# EAGLE design old_motor+line (EAGLE 7.7.0)
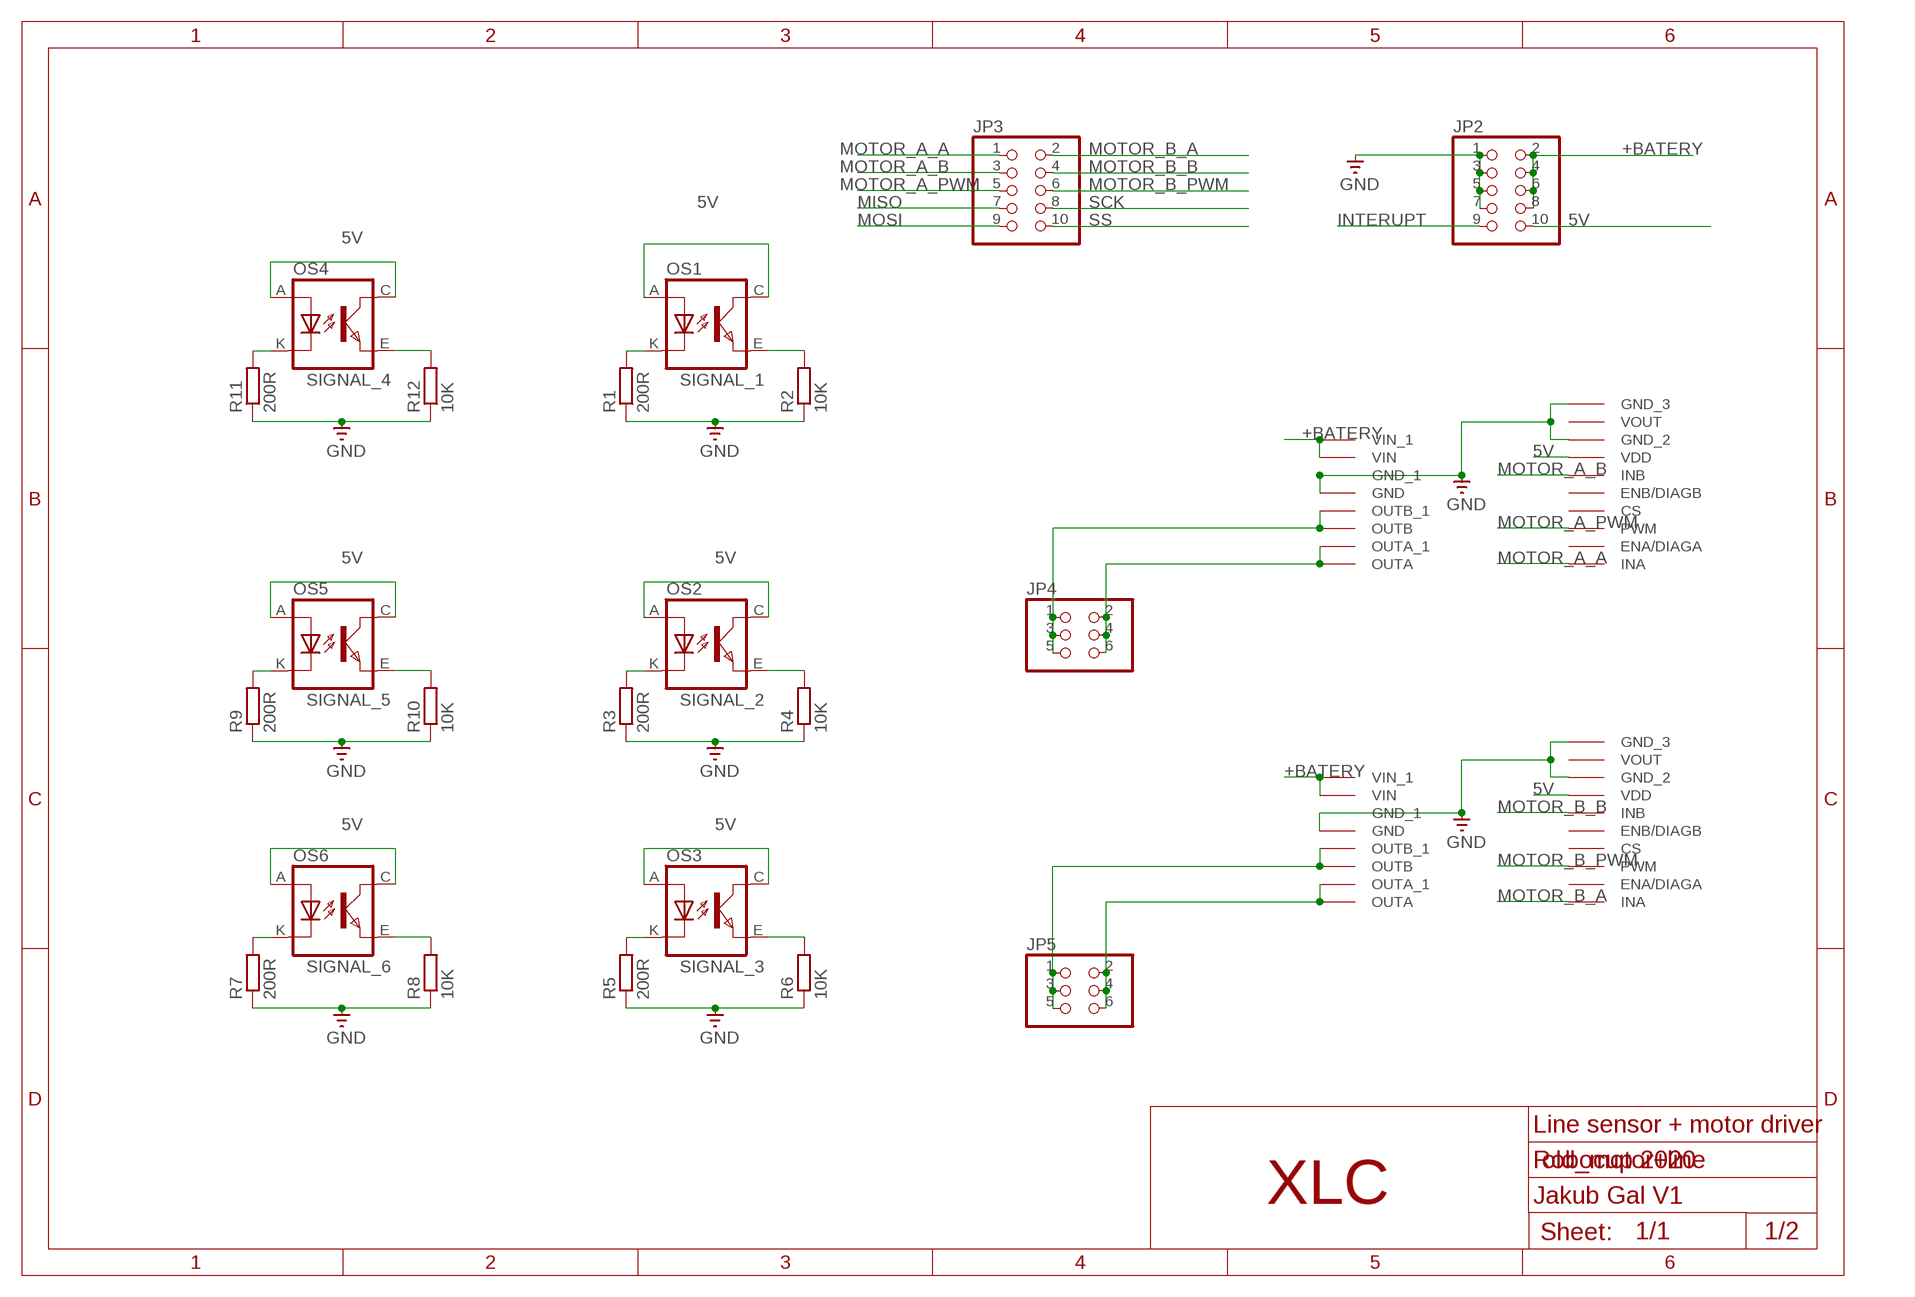
[diagram p0: schematic, sheet 1, part 1 of 2]
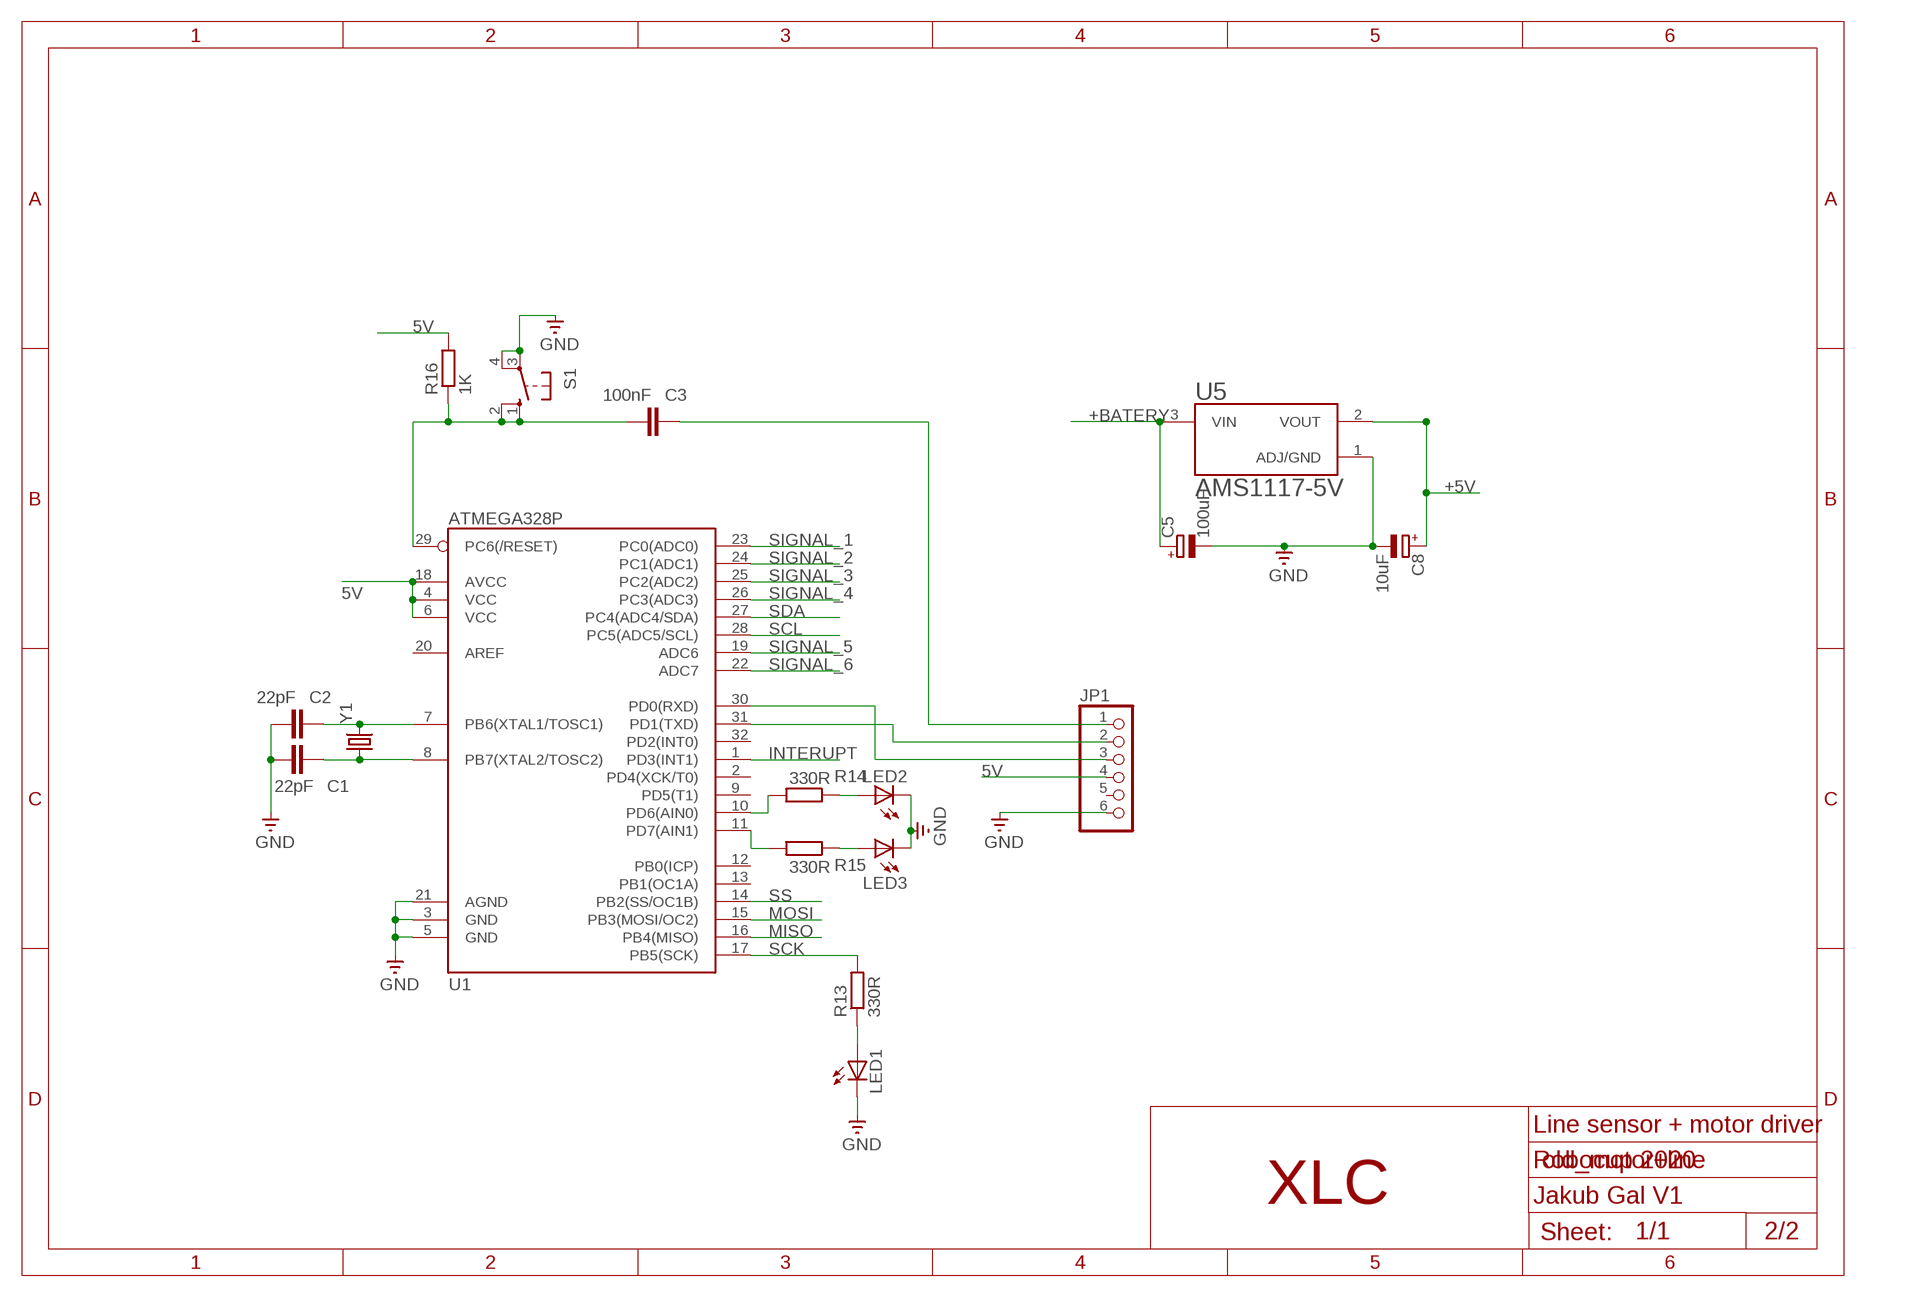
[diagram p1: schematic, sheet 1, part 2 of 2]

## Parts
C1  22pF  C-EUC0603  [C0603]
C2  22pF  C-EUC0603  [C0603]
C3  100nF  C-EUC0603  [C0603]
C5  100uF  CPOL-EUUD-6,3X7,7  [UD-6,3X7,7_NICHICON]
C8  10uF  CPOL-EUUD-4X5,8  [UD-4X5,8_NICHICON]
JP1  PINHD-1X6/90  [1X06/90]
JP2  PINHD-2X5  [2X05]
JP3  PINHD-2X5  [2X05]
JP4  PINHD-2X3  [2X03]
JP5  PINHD-2X3  [2X03]
LED1  LEDCHIPLED_0603  [CHIPLED_0603]
LED2  LEDCHIPLED_0603  [CHIPLED_0603]
LED3  LEDCHIPLED_0603  [CHIPLED_0603]
OS1  TCRT5000  [TCRT5000]
OS2  TCRT5000  [TCRT5000]
OS3  TCRT5000  [TCRT5000]
OS4  TCRT5000  [TCRT5000]
OS5  TCRT5000  [TCRT5000]
OS6  TCRT5000  [TCRT5000]
R1  200R  R-EU_R0603  [R0603]
R2  10K  R-EU_R0603  [R0603]
R3  200R  R-EU_R0603  [R0603]
R4  10K  R-EU_R0603  [R0603]
R5  200R  R-EU_R0603  [R0603]
R6  10K  R-EU_R0603  [R0603]
R7  200R  R-EU_R0603  [R0603]
R8  10K  R-EU_R0603  [R0603]
R9  200R  R-EU_R0603  [R0603]
R10  10K  R-EU_R0603  [R0603]
R11  200R  R-EU_R0603  [R0603]
R12  10K  R-EU_R0603  [R0603]
R13  330R  R-EU_R0603  [R0603]
R14  330R  R-EU_R0603  [R0603]
R15  330R  R-EU_R0603  [R0603]
R16  1K  R-EU_R0603  [R0603]
S1  10-XX  [B3F-10XX]
U1  ATMEGA328P  ATMEGA328_SMT  [TQFP32-08]
U5  AMS1117-5V  AMS1117-3.3  [SOT229P700X180-4N]
U$1  MOTOR_DRIVER  [MOTOR_DRIVER]
U$2  MOTOR_DRIVER  [MOTOR_DRIVER]
Y1  CRYSTALHC49US  [HC49US]

## Nets
5V: JP1.4 JP2.10 OS1.A(ANODE) OS1.C(COLLECTOR) OS2.A(ANODE) OS2.C(COLLECTOR) OS3.A(ANODE) OS3.C(COLLECTOR) OS4.A(ANODE) OS4.C(COLLECTOR) OS5.A(ANODE) OS5.C(COLLECTOR) OS6.A(ANODE) OS6.C(COLLECTOR) R16.2 U1.4(VCC) U1.6(VCC) U1.18(AVCC) U$1.VDD U$2.VDD
+5V: C8.+ U5.2(VOUT)
+BATERY: C5.+ JP2.2 JP2.4 JP2.6 JP2.8 U5.3(VIN) U$1.VIN U$1.VIN_1 U$2.VIN U$2.VIN_1
GND: C1.1 C2.1 C5.- C8.- JP1.6 JP2.1 JP2.3 JP2.5 JP2.7 LED1.C LED2.C LED3.C R1.1 R2.1 R3.1 R4.1 R5.1 R6.1 R7.1 R8.1 R9.1 R10.1 R11.1 R12.1 S1.3(P) S1.4(P1) U1.3(GND) U1.5(GND) U1.21(AGND) U5.1(ADJ/GND) U$1.GND U$1.GND_1 U$1.GND_2 U$1.GND_3 U$2.GND U$2.GND_1 U$2.GND_2 U$2.GND_3
INTERUPT: JP2.9 U1.1(PD3(INT1))
MISO: JP3.7 U1.16(PB4(MISO))
MOSI: JP3.9 U1.15(PB3(MOSI/OC2))
MOTOR_1_1: JP4.1 JP4.3 JP4.5 U$1.OUTB U$1.OUTB_1
MOTOR_1_2: JP4.2 JP4.4 JP4.6 U$1.OUTA U$1.OUTA_1
MOTOR_2_1: JP5.2 JP5.4 JP5.6 U$2.OUTA U$2.OUTA_1
MOTOR_2_2: JP5.1 JP5.3 JP5.5 U$2.OUTB U$2.OUTB_1
MOTOR_A_A: JP3.1 U$1.INA
MOTOR_A_B: JP3.3 U$1.INB
MOTOR_A_PWM: JP3.5 U$1.PWM
MOTOR_B_A: JP3.2 U$2.INA
MOTOR_B_B: JP3.4 U$2.INB
MOTOR_B_PWM: JP3.6 U$2.PWM
N$1: OS1.K(CATHODE) R1.2
N$2: OS2.K(CATHODE) R3.2
N$3: OS3.K(CATHODE) R5.2
N$4: OS6.K(CATHODE) R7.2
N$5: OS5.K(CATHODE) R9.2
N$6: OS4.K(CATHODE) R11.2
N$7: C2.2 U1.7(PB6(XTAL1/TOSC1)) Y1.2
N$8: C1.2 U1.8(PB7(XTAL2/TOSC2)) Y1.1
N$13: JP1.3 U1.30(PD0(RXD))
N$14: JP1.2 U1.31(PD1(TXD))
N$15: C3.2 JP1.1
N$16: C3.1 R16.1 S1.1(S) S1.2(S1) U1.29(PC6(/RESET))
N$17: LED1.A R13.1
N$19: LED2.A R14.1
N$20: R15.2 U1.11(PD7(AIN1))
N$21: LED3.A R15.1
N$22: R14.2 U1.10(PD6(AIN0))
SCK: JP3.8 R13.2 U1.17(PB5(SCK))
SCL: U1.28(PC5(ADC5/SCL))
SDA: U1.27(PC4(ADC4/SDA))
SIGNAL_1: OS1.E(EMITTER) R2.2 U1.23(PC0(ADC0))
SIGNAL_2: OS2.E(EMITTER) R4.2 U1.24(PC1(ADC1))
SIGNAL_3: OS3.E(EMITTER) R6.2 U1.25(PC2(ADC2))
SIGNAL_4: OS4.E(EMITTER) R12.2 U1.26(PC3(ADC3))
SIGNAL_5: OS5.E(EMITTER) R10.2 U1.19(ADC6)
SIGNAL_6: OS6.E(EMITTER) R8.2 U1.22(ADC7)
SS: JP3.10 U1.14(PB2(SS/OC1B))
Unconnected: JP1.5 U1.2(PD4(XCK/T0)) U1.9(PD5(T1)) U1.12(PB0(ICP)) U1.13(PB1(OC1A)) U1.20(AREF) U1.32(PD2(INT0)) U$1.CS U$1.ENA/DIAGA U$1.ENB/DIAGB U$1.VOUT U$2.CS U$2.ENA/DIAGA U$2.ENB/DIAGB U$2.VOUT

## Notes on the sheet
- Line sensor + motor driver | Line sensor + motor driver
- Robocup 2020 | Robocup 2020
- XLC | Jakub Gal V1 | XLC | Jakub Gal V1
- 1/2 | 2/2

## Library data of the parts
C1-C3 = rcl@1:C-EU: CAPACITOR, European symbol
C5 C8 = rcl:CPOL-EU: POLARIZED CAPACITOR, European symbol; SPICEPREFIX: C
JP1 = SERVO:PINHD-1X6: PIN HEADER
JP2 JP3 = pinhead:PINHD-2X5: PIN HEADER
JP4 JP5 = pinhead:PINHD-2X3: PIN HEADER
LED1-LED3 = audio amplifier example:LED
OS1-OS3 OS5 = tcrt5000:TCRT5000
OS4 OS6 = tcrt5000:TCRT5000; SPICEPREFIX: O
R1-R16 = rcl:R-EU_: RESISTOR, European symbol; SPICEPREFIX: R
S1 = switch-omron:10-XX: OMRON SWITCH; MPN: B3F-1000; OC_FARNELL: 176432; OC_NEWARK: 36M3542
U1 = SparkFun-DigitalIC:ATMEGA328_SMT: 32-Pin Atmega328 part Commonly used on Arduino compatible boards Available in QFP and QFN packages TQFP is IC-09069 QFN is non-stock; PROD_ID: IC-09069
U5 = AMS1117-3.3:AMS1117-3.3: Sot223/Pkg 1-Amp 3.3-Volt Low Drop Out Voltage Regulatator; AVAILABILITY: Unavailable; DESCRIPTION: Sot223/Pkg 1-Amp 3.3-Volt Low Drop Out Voltage Regulatator; MF: Advanced Monolithic Systems; MP: AMS1117-3.3; PACKAGE: None; PRICE: None
U$1 U$2 = Moja:MOTOR_DRIVER
Y1 = SparkFun-FreqCtrl:CRYSTAL: Various standard crystals. Proven footprints. Spark Fun Electronics SKU : COM-00534

## Board
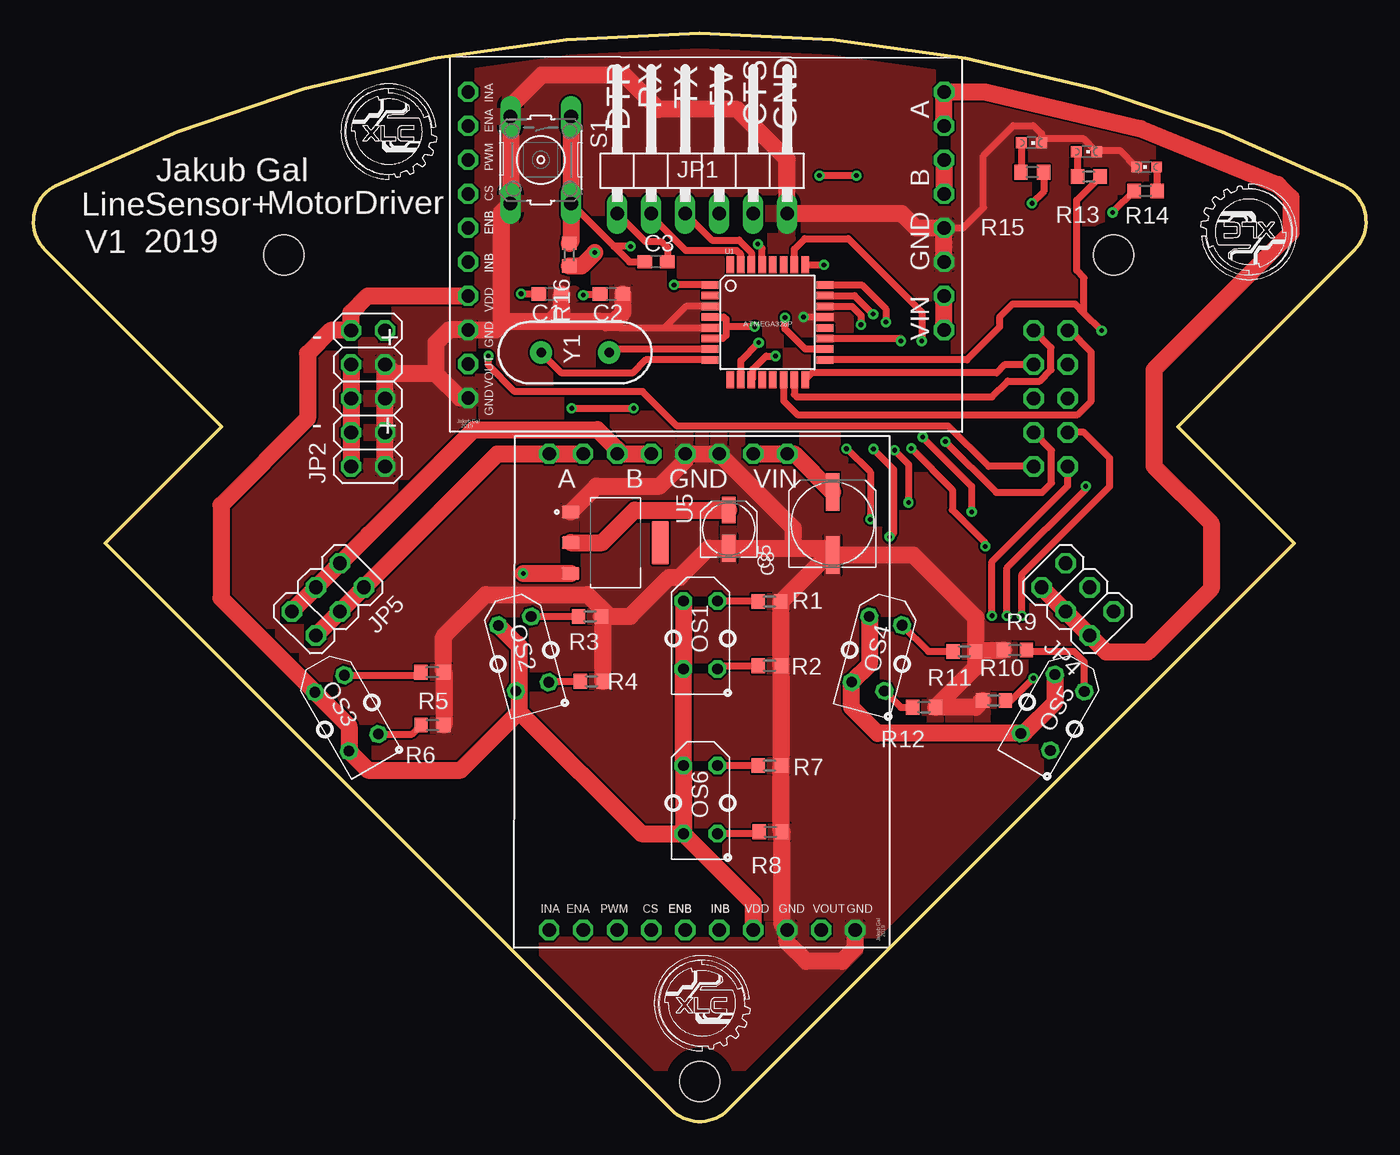
[diagram p2: board, top side]
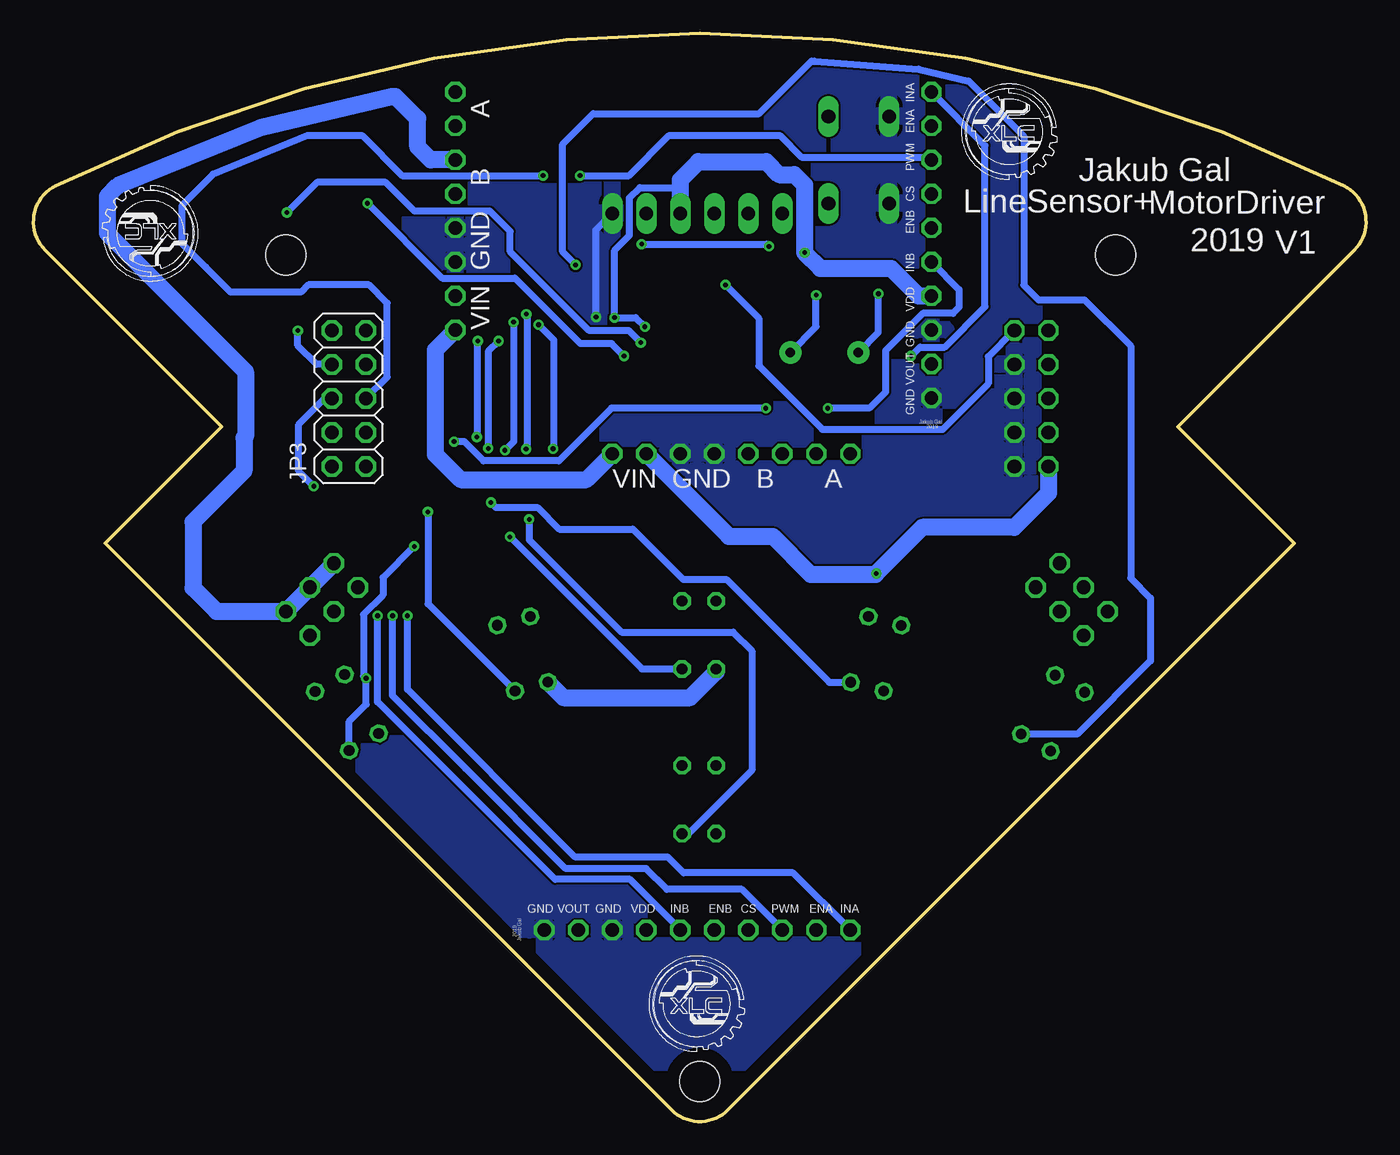
[diagram p3: board, bottom side, seen from below]

Size 99.55 x 81.25 mm. Coordinates in mm from the lower left corner, seen from the top.
Outline: 85.49,51.89 98.67,65.08 arc108 97.9,69.88 arc53 1.66,69.88 arc108 0.88,65.08 14.07,51.89 5.35,43.18 47.66,0.87 arc90 51.9,0.87 94.2,43.18 85.49,51.89
Copper layers (1*16): Top 0.035mm / dielectric 1.5mm / Bottom 0.035mm
Design rules "default": minimum track width 6mil, minimum drill 0.35mm, track to track 6mil, track to pad 6mil, pad to pad 6mil, via to via 6mil, smd to smd 6mil, copper to edge 40mil, drill to drill 6mil, minimum pad ring 10mil, minimum via ring 8mil, stop-mask expansion 4mil, vias tented up to drill 0mil, thermal gap 10mil
Holes 3 mm at 49.78,3 18.71,64.71 80.71,64.71

### Footprints (pad centres in the part's own frame; a part is rotated, then mirrored left to right if it is on the bottom)
C0603 = smd 1.1 x 1: 1 -0.85,0; 2 0.85,0
UD-6,3X7,7_NICHICON = smd 2.8 x 1: + 2.35,0; - -2.35,0
UD-4X5,8_NICHICON = smd 2 x 1: + 1.425,0; - -1.425,0
1X06/90 = drill 1.016 long: 1 -6.35,-3.81; 2 -3.81,-3.81; 3 -1.27,-3.81; 4 1.27,-3.81; 5 3.81,-3.81; 6 6.35,-3.81
2X05 = drill 1.016 octagon: 1 -5.08,-1.27; 2 -5.08,1.27; 3 -2.54,-1.27; 4 -2.54,1.27; 5 0,-1.27; 6 0,1.27; 7 2.54,-1.27; 8 2.54,1.27; 9 5.08,-1.27; 10 5.08,1.27
2X03 = drill 1.016 octagon: 1 -2.54,-1.27; 2 -2.54,1.27; 3 0,-1.27; 4 0,1.27; 5 2.54,-1.27; 6 2.54,1.27
CHIPLED_0603 = smd 0.8 x 0.8: A 0,-0.75; C 0,0.75
TCRT5000 = drill 0.8 octagon: A -2.54,-1.27; C 2.54,-1.27; E 2.54,1.27; K -2.54,1.27
R0603 = smd 1 x 1.1: 1 -0.85,0; 2 0.85,0
B3F-10XX = drill 1.016 long: 1 -3.251,2.261; 2 3.251,2.261; 3 -3.251,-2.261; 4 3.251,-2.261
TQFP32-08 = smd 1.27 x 0.559: 1 -4.293,2.8; 2 -4.293,2; 3 -4.293,1.2; 4 -4.293,0.4; 5 -4.293,-0.4; 6 -4.293,-1.2; 7 -4.293,-2; 8 -4.293,-2.8; 17 4.293,-2.8; 18 4.293,-2; 19 4.293,-1.2; 20 4.293,-0.4; 21 4.293,0.4; 22 4.293,1.2; 23 4.293,2; 24 4.293,2.8 | smd 0.559 x 1.27: 9 -2.8,-4.293; 10 -2,-4.293; 11 -1.2,-4.293; 12 -0.4,-4.293; 13 0.4,-4.293; 14 1.2,-4.293; 15 2,-4.293; 16 2.8,-4.293; 25 2.8,4.293; 26 2,4.293; 27 1.2,4.293; 28 0.4,4.293; 29 -0.4,4.293; 30 -1.2,4.293; 31 -2,4.293; 32 -2.8,4.293
SOT229P700X180-4N = smd 0.93 x 1.31: 1 -2.29,-3.345; 2 0,-3.345; 3 2.29,-3.345 | smd 3.24 x 1.31: 4 0,3.345
MOTOR_DRIVER = drill 1 octagon: CS -2.54,-17.78; ENA/DIAGA -7.62,-17.78; ENB/DIAGB 0,-17.78; GND 0,17.78; GND_1 2.54,17.78; GND_2 7.62,-17.78; GND_3 12.7,-17.78; INA -10.16,-17.78; INB 2.54,-17.78; OUTA -10.16,17.78; OUTA_1 -7.62,17.78; OUTB -5.08,17.78; OUTB_1 -2.54,17.78; PWM -5.08,-17.78; VDD 5.08,-17.78; VIN 5.08,17.78; VIN_1 7.62,17.78; VOUT 10.16,-17.78
HC49US = drill 0.7 pad 1.651: 1 -2.54,0; 2 2.54,0

### Placement (x,y rotation side)
C1  38.61,61.8 180 top
C2  43.18,61.8 180 top
C3  46.51,64.21 0 top
C5  59.7,44.66 90 top
C8  51.94,44.24 90 top
JP1  49.96,71.63 0 top
JP2  25,54 90 top
JP3  76,54 90 bottom
JP4  78,39 135 top
JP5  22,39 225 top
LED1  78.67,72.43 270 top
LED2  83.16,71.28 90 top
LED3  74.55,73.09 270 top
OS1  49.83,36.34 270 top
OS2  36.61,34.93 285 top
OS3  23.4,30.5 300 top
OS4  63.01,34.94 255 top
OS5  76.13,30.54 240 top
OS6  49.83,24.04 270 top
R1  54.99,38.83 180 top
R2  55,34.04 180 top
R3  41.57,37.72 180 top
R4  41.7,32.88 180 top
R5  29.8,33.56 180 top
R6  29.81,29.61 180 top
R7  55,26.58 180 top
R8  55.07,21.64 180 top
R9  73.33,35.21 0 top
R10  71.76,31.45 0 top
R11  69.56,35.11 180 top
R12  66.54,30.94 180 top
R13  78.85,70.57 0 top
R14  83.08,69.5 180 top
R15  74.62,70.9 0 top
R16  40.03,64.74 270 top
S1  37.9,71.82 270 top
U1  54.84,59.68 0 top
U5  43.48,43.23 270 top
U$1  50.25,66.74 270 top
U$2  48.69,32.09 0 top
Y1  40.47,57.43 0 top

### Tracks (layer width: path | path; a pad name or v marks a point on that pad's centre or on a via)
5V  (via drill 0.35)
  Top 0.508: U1.4 51.58,60.08 51.74,59.92 51.74,59.34 | 51.74,59.34 51.74,58.71 51.51,58.48 U1.6 | U1.18 57.66,57.68 56.14,59.2 v56.14,60.04 | v53.88,59.36 53.86,59.34 51.74,59.34
  Top 1.27: U$1.VDD 24.98,61.66 23.73,60.41 JP2.10 22.22,59.08 20.48,57.34 20.48,52.51 14.01,46.04 14.01,39.08 OS3.A 23.57,29.52 OS3.C 24.98,26.25 31.92,26.25 36.29,30.62 | OS6.C OS6.A OS1.C OS1.A | OS4.A 62.44,34.13 OS4.C 61.12,30.92 63.07,28.98 OS5.C 74.01,28.98 76.3,31.28 OS5.A | OS2.A 35.96,35.82 35.97,35.82 36.29,35.5 36.29,32.39 | 36.29,32.39 OS2.C | 36.29,32.39 36.29,30.62 | 36.29,30.62 45.41,21.5 OS6.C | OS6.C 53.77,16.29 U$2.VDD | v41.94,64.89 40.94,63.89 R16.2
  Bottom 0.508: v53.88,59.36 54.56,60.04 v56.14,60.04 56.14,65.06 55.03,66.17 55.03,68.97 54.25,69.75 51.45,69.75 51.23,69.97 51.23,70.33
  Bottom 1.27: OS4.C 59.97,31.66 59.97,31.65 50.49,31.65 48.56,33.58 OS1.C | JP1.4 51.23,70.33 49.88,71.68 44.81,71.68 43.85,70.72 42.71,70.72 41.94,69.95 v41.94,64.89 40.76,63.71 35.49,63.71 33.44,61.66 U$1.VDD
+5V
  Top 1.27: U5.2 42.48,43.23 44.91,45.66 C8.+
+BATERY  (via drill 0.35)
  Top 1.27: U$2.VIN U$2.VIN_1 56.84,49.87 C5.+ | U$1.VIN_1 U$1.VIN | JP2.8 JP2.6 JP2.4 JP2.2 | v36.59,40.93 v36.6,40.94 U5.3
  Bottom 1.27: JP2.2 23.73,46.93 26.29,44.37 33.15,44.37 v36.59,40.93 36.65,40.87 41.49,40.87 44.32,43.7 47.6,43.7 U$2.VIN | U$2.VIN_1 58.25,47.93 67.64,47.93 69.54,49.83 69.54,57.61 U$1.VIN_1
GND  (via drill 0.35)
  Top 0.508: 43.89,59.28 47.16,59.28 | 47.16,59.28 U1.5 | U1.3 48.76,60.88 47.16,59.28 | 43.39,59.78 43.89,59.28 | 43.89,59.28 42.73,59.28 42.23,59.78 | LED2.C 81.2,72.49 79.48,72.49 LED1.C 78.46,73.39 75.6,73.39 LED3.C 75.3,73.77 74.7,74.37 73.2,74.37 70.97,72.14 70.97,68.25 69.46,66.74 U$1.GND | U1.21 v57.53,60.08
  Top 1.27: 30.06,55.84 30.06,58.13 31.05,59.12 U$1.GND_2 34.56,59.12 34.95,59.51 34.95,67.88 S1.4 S1.3 35.64,75.81 37.97,78.14 44.15,78.14 46.7,75.59 52.57,75.59 56.31,71.85 JP1.6 64.85,67.82 65.93,66.74 U$1.GND U$1.GND_1 | 30.06,55.84 31.86,54.04 U$1.GND_3 | 38.67,59.78 39.46,60.57 C1.1 | 35.22,59.78 38.67,59.78 | C2.1 44.03,60.42 43.39,59.78 42.23,59.78 38.67,59.78 | JP2.1 JP2.3 JP2.5 JP2.7 26.97,55.84 30.06,55.84 | U5.1 42.06,47.45 46.78,47.45 48.69,49.36 U$2.GND U$2.GND_1 56.76,44.34 56.76,42.81 | 56.76,42.81 C8.- 50.44,42.81 48.27,40.64 47.49,40.64 44.57,37.72 43.02,37.72 | 56.76,42.81 59.19,42.81 C5.- | C5.- 59.7,42.14 | U$2.GND_3 61.39,12.95 60.41,11.97 57.74,11.97 56.31,13.4 U$2.GND_2 55.92,14.7 R8.1 55.85,21.71 R7.1 R2.1 R1.1 59.32,42.31 C5.- | R11.1 70.41,33.96 R12.1 70.4,30.94 R10.1 | R11.1 70.51,35.21 R9.1 | R11.1 70.41,37.63 65.73,42.31 C5.- | R6.1 R5.1 30.65,36.23 33.78,39.36 41.38,39.36 43.02,37.72 | R4.1 42.55,37.59 R3.1 43.02,37.72
  Bottom 0.508: JP1.6 57.53,66.6 v57.53,60.08
  pour Top: -9,-2 109,-2 109,87 -9,87
  pour Bottom: 111,92 111,-3 -11,-3 -11,92
INTERUPT  (via drill 0.35)
  Top 0.508: U1.1 v47.86,62.48
  Bottom 0.508: v47.86,62.48 45.36,59.98 45.36,56.44 40.62,51.7 31.63,51.7 28.22,55.11 28.22,57.13 JP2.9
MISO
  Top 0.508: U1.16 58.17,55.91 71.97,55.91 72.59,56.54 JP3.7
MOSI
  Top 0.508: U1.15 56.84,54.31 57.03,54.12 71.62,54.12 72.79,55.29 75.17,55.29 76.02,56.14 76.02,57.79 JP3.9
MOTOR_1_1
  Top 1.27: U$1.OUTB U$1.OUTB_1
  Bottom 1.27: JP4.3 JP4.1 85.88,38.1 87.63,39.85 87.63,44.79 83.82,48.6 83.82,51.04 83.71,51.15 83.71,56 94.04,66.34 94.04,69.07 93.24,69.87 82.54,74.22 72.75,76.54 72.5,76.54 70.85,74.89 70.85,72.79 69.88,71.82 U$1.OUTB | JP4.3 | JP4.3 JP4.5 | JP4.5
MOTOR_1_2
  Top 1.27: U$1.OUTA_1 U$1.OUTA 71.1,76.9 82.72,74.15 92.97,69.98 93.95,69 93.95,66.37 83.71,56.13 83.71,48.95 87.98,44.68 87.98,39.8 83.24,35.06 80.14,35.06 JP4.2 JP4.4 | JP4.4 | JP4.6 JP4.4
MOTOR_2_1
  Top 1.27: JP5.6 JP5.4 | JP5.4 | JP5.4 | JP5.4 JP5.2 34.66,49.87 U$2.OUTA U$2.OUTA_1
MOTOR_2_2
  Top 1.27: JP5.3 JP5.1 25.03,43.83 25.04,43.83 32.89,51.68 42.14,51.68 43.61,50.21 U$2.OUTB U$2.OUTB_1 | JP5.3 | JP5.3 JP5.5 | JP5.5
MOTOR_A_A  (via drill 0.35)
  Top 0.508: JP3.1 71.37,48.92 68.35,51.94 48.09,51.94 45.51,54.52 35.96,54.52 33.99,56.49 v33.99,57.17
  Bottom 0.508: v33.99,57.17 33.32,57.84 31.47,57.84 28.46,60.85 28.46,72.89 U$1.INA
MOTOR_A_B  (via drill 0.35)
  Top 0.508: v40.21,53.27 v44.84,53.27 | JP3.3 76.06,50.13 76.06,47.67 75.37,46.98 71.93,46.98 v68.13,50.78
  Bottom 0.508: U$1.INB 30.4,62.13 30.4,60.82 30.86,60.36 33.12,60.36 35.9,57.58 35.9,54.48 37.11,53.27 v40.21,53.27 | v44.84,53.27 56.37,53.27 60.29,49.34 65.93,49.34 67.36,50.77 67.36,50.78 v68.13,50.78
MOTOR_A_PWM  (via drill 0.35)
  Top 0.508: v61.49,70.64 v58.72,70.64
  Bottom 0.508: JP3.5 73.13,55.6 73.13,61.12 74.49,62.48 79.02,62.48 79.56,61.94 84.83,61.94 86.68,63.79 86.68,63.8 88.44,65.56 88.44,68.44 86.13,70.75 79.03,73.64 75.01,73.64 72.01,70.64 v61.49,70.64 | v58.72,70.64 55.07,70.64 52.07,73.64 43.8,73.64 42.19,72.03 32.68,72.03 U$1.PWM
MOTOR_B_A  (via drill 0.35)
  Top 0.508: v71.61,37.77 71.61,41.8 77.27,47.46 JP3.2
  Bottom 0.508: U$2.INA 42.8,18.58 50.99,18.58 52.16,19.75 59.09,19.75 71.61,32.27 v71.61,37.77
MOTOR_B_B  (via drill 0.35)
  Top 0.508: v73.84,37.77 73.84,40.88 80.4,47.44 80.4,49.54 78.48,51.46 JP3.4
  Bottom 0.508: U$2.INB 55,18.08 60.58,18.08 73.84,31.34 v73.84,37.77
MOTOR_B_PWM  (via drill 0.35)
  Top 0.508: v72.73,37.77 72.73,41.34 78.61,47.23 v78.61,47.45
  Bottom 0.508: U$2.PWM 46.64,17.34 52.24,17.34 53.78,18.88 59.79,18.88 67.28,26.37 67.29,26.37 72.73,31.8 v72.73,37.77 | v78.61,47.45 79.74,48.58 79.74,52.07 77.81,54 JP3.6
N$1
  Top 0.508: OS1.K 54.09,38.88 R1.2
N$2
  Top 0.508: OS2.K R3.2
N$3
  Top 0.508: OS3.K 28.72,33.33 R5.2
N$4
  Top 0.508: R7.2 OS6.K
N$5
  Top 0.508: OS5.K 78.5,34.35 77.75,35.1 74.29,35.1 R9.2
N$6
  Top 0.508: OS4.K 66.85,35.11 R11.2
N$7  (via drill 0.35)
  Top 0.508: v41.08,61.72 41.16,61.8 C2.2 | Y1.2 43.26,57.68 U1.7
  Bottom 0.508: Y1.2 41.08,59.36 v41.08,61.72
N$8  (via drill 0.35)
  Top 0.508: v36.43,61.82 37.74,61.82 C1.2 | U1.8 45.73,56.88 44.75,55.9 39.46,55.9 Y1.1
  Bottom 0.508: Y1.1 36.43,58.93 v36.43,61.82
N$13
  Top 0.508: JP1.3 50.69,65.82 52.71,65.82 53.64,64.89 U1.30
N$14
  Top 0.508: U1.31 52.84,64.76 52.55,65.05 48.75,65.05 46.15,67.65 JP1.2
N$15
  Top 0.508: JP1.1 45.69,65.74 46.87,65.74 47.36,65.25 C3.2
N$16  (via drill 0.35)
  Top 0.508: S1.2 43.36,65.37 43.37,65.36 | 43.37,65.36 44.52,64.21 C3.1 | U1.29 54.44,65.2 v54.12,65.52 | v44.6,65.36 43.37,65.36
  Top 1.27: S1.1 S1.2 40.16,65.72 R16.1
  Bottom 0.508: v54.12,65.52 44.77,65.52 v44.6,65.36
N$17
  Top 0.508: LED1.A 78,72.35 R13.1
N$19
  Top 0.508: LED2.A 83.93,71.26 R14.1
N$20  (via drill 0.35)
  Top 0.508: U1.11 53.75,55.5 53.75,56.19 54.73,57.17 v55.43,57.17 | R15.2 75.47,69.45 v74.6,68.58
  Bottom 0.508: v55.43,57.17 56.36,58.1 58.7,58.1 63.59,62.99 69.01,62.99 v74.6,68.58
N$21
  Top 0.508: LED3.A 73.8,70.93 R15.1
N$22  (via drill 0.35)
  Top 0.508: R14.2 v80.62,67.89 | U1.10 52.84,56.83 v54.18,58.17
  Bottom 0.508: v54.18,58.17 55.07,59.06 58.03,59.06 63.94,64.97 63.94,66.48 65.46,68 71.09,68 73.23,70.14 78.37,70.14 v80.62,67.89
SCK  (via drill 0.35)
  Top 0.508: v79.8,59.07 78.49,60.38 | R13.2 77.94,68.8 77.94,63.56 78.49,63.01 78.49,60.38 | 78.49,60.38 77.83,61.04 73.15,61.04 72.18,60.07 72.18,59.32 69.74,56.88 U1.17
  Bottom 0.508: JP3.8 78.4,56.54 79.8,57.94 v79.8,59.07
SIGNAL_1  (via drill 0.35)
  Top 0.508: OS1.E 51.34,34.04 R2.2 | U1.23 61.35,61.68 v62.73,60.3 | v62.75,50.23 62.75,50.2 64.25,48.7 64.25,43.95 v63.96,43.66
  Bottom 0.508: v62.75,50.23 62.69,50.23 62.69,60.26 v62.73,60.3 | OS1.E 54.1,33.8 v63.96,43.66
SIGNAL_2  (via drill 0.35)
  Top 0.508: OS2.E 38.57,32.88 R4.2 | U1.24 61.89,62.48 63.68,60.69 v63.68,59.7 | v64.33,50.13 65.38,49.08 v65.38,46.23
  Bottom 0.508: v63.68,59.7 63.68,50.78 v64.33,50.13 | v65.38,46.23 65.02,45.87 61.9,45.87 60.28,44.25 54.77,44.25 51.01,40.49 47.78,40.49 40.09,32.8 OS2.E
SIGNAL_3  (via drill 0.35)
  Top 0.508: OS3.E 28.28,28.93 R6.2 | U1.25 v59.05,63.97
  Bottom 0.508: v59.05,63.97 60.02,64.94 60.02,73 57.74,75.28 45.34,75.28 41.42,79.19 41.21,79.19 33.43,78.59 29.68,77.7 25.57,73.6 25.57,62.46 24.47,61.36 21.03,61.36 17.59,57.92 17.59,40.58 16.1,39.09 16.1,34.41 21.57,28.93 OS3.E
SIGNAL_4  (via drill 0.35)
  Top 0.508: OS4.E 64.8,30.94 R12.2 | U1.26 56.84,65.15 57.62,65.93 60.87,65.93 66.36,60.44 v66.36,58.29 | v66.43,51.12 70.09,47.46 v70.09,45.53
  Bottom 0.508: v66.36,58.29 66.43,58.22 v66.43,51.12 | v70.09,45.53 70.09,38.67 OS4.E
SIGNAL_5  (via drill 0.35)
  Top 0.508: v74.7,33.1 73.05,31.45 R10.2 | U1.19 64.81,58.48 v64.81,58.29 | v65.58,50.27 68.65,47.2 68.65,45.68 71.11,43.22 v71.11,42.95
  Bottom 0.508: OS5.E 75.96,29.88 74.7,31.15 v74.7,33.1 74.89,33.29 74.89,37.87 73.44,39.32 73.44,40.62 v71.11,42.95 | v64.81,58.29 65.58,57.52 v65.58,50.27
SIGNAL_6  (via drill 0.35)
  Top 0.508: R8.2 54.08,21.5 OS6.E | U1.22 61.15,60.88 61.82,60.21 v61.82,59.5 | v60.73,50.25 60.78,50.25 62.52,48.51 v62.52,44.97
  Bottom 0.508: v62.52,44.97 62.52,43.44 55.63,36.55 47.29,36.55 45.89,35.15 45.89,26.23 50.62,21.5 OS6.E | v61.82,59.5 60.69,58.37 60.69,50.29 v60.73,50.25
SS
  Top 0.508: U1.14 56.04,53.82 57.07,52.79 78.01,52.79 79.02,53.8 79.02,57.47 77.41,59.08 JP3.10

### Text on the board
tNames: RX | TX | 5V | DTR | CTS | GND | Jakub Gal | LineSensor+ | MotorDriver | V1 | 2019 | - | + | - | +
bNames: Jakub Gal | MotorDriver | LineSensor+ | V1 | 2019